# EAGLE schematic mainboard (EAGLE 6.2)
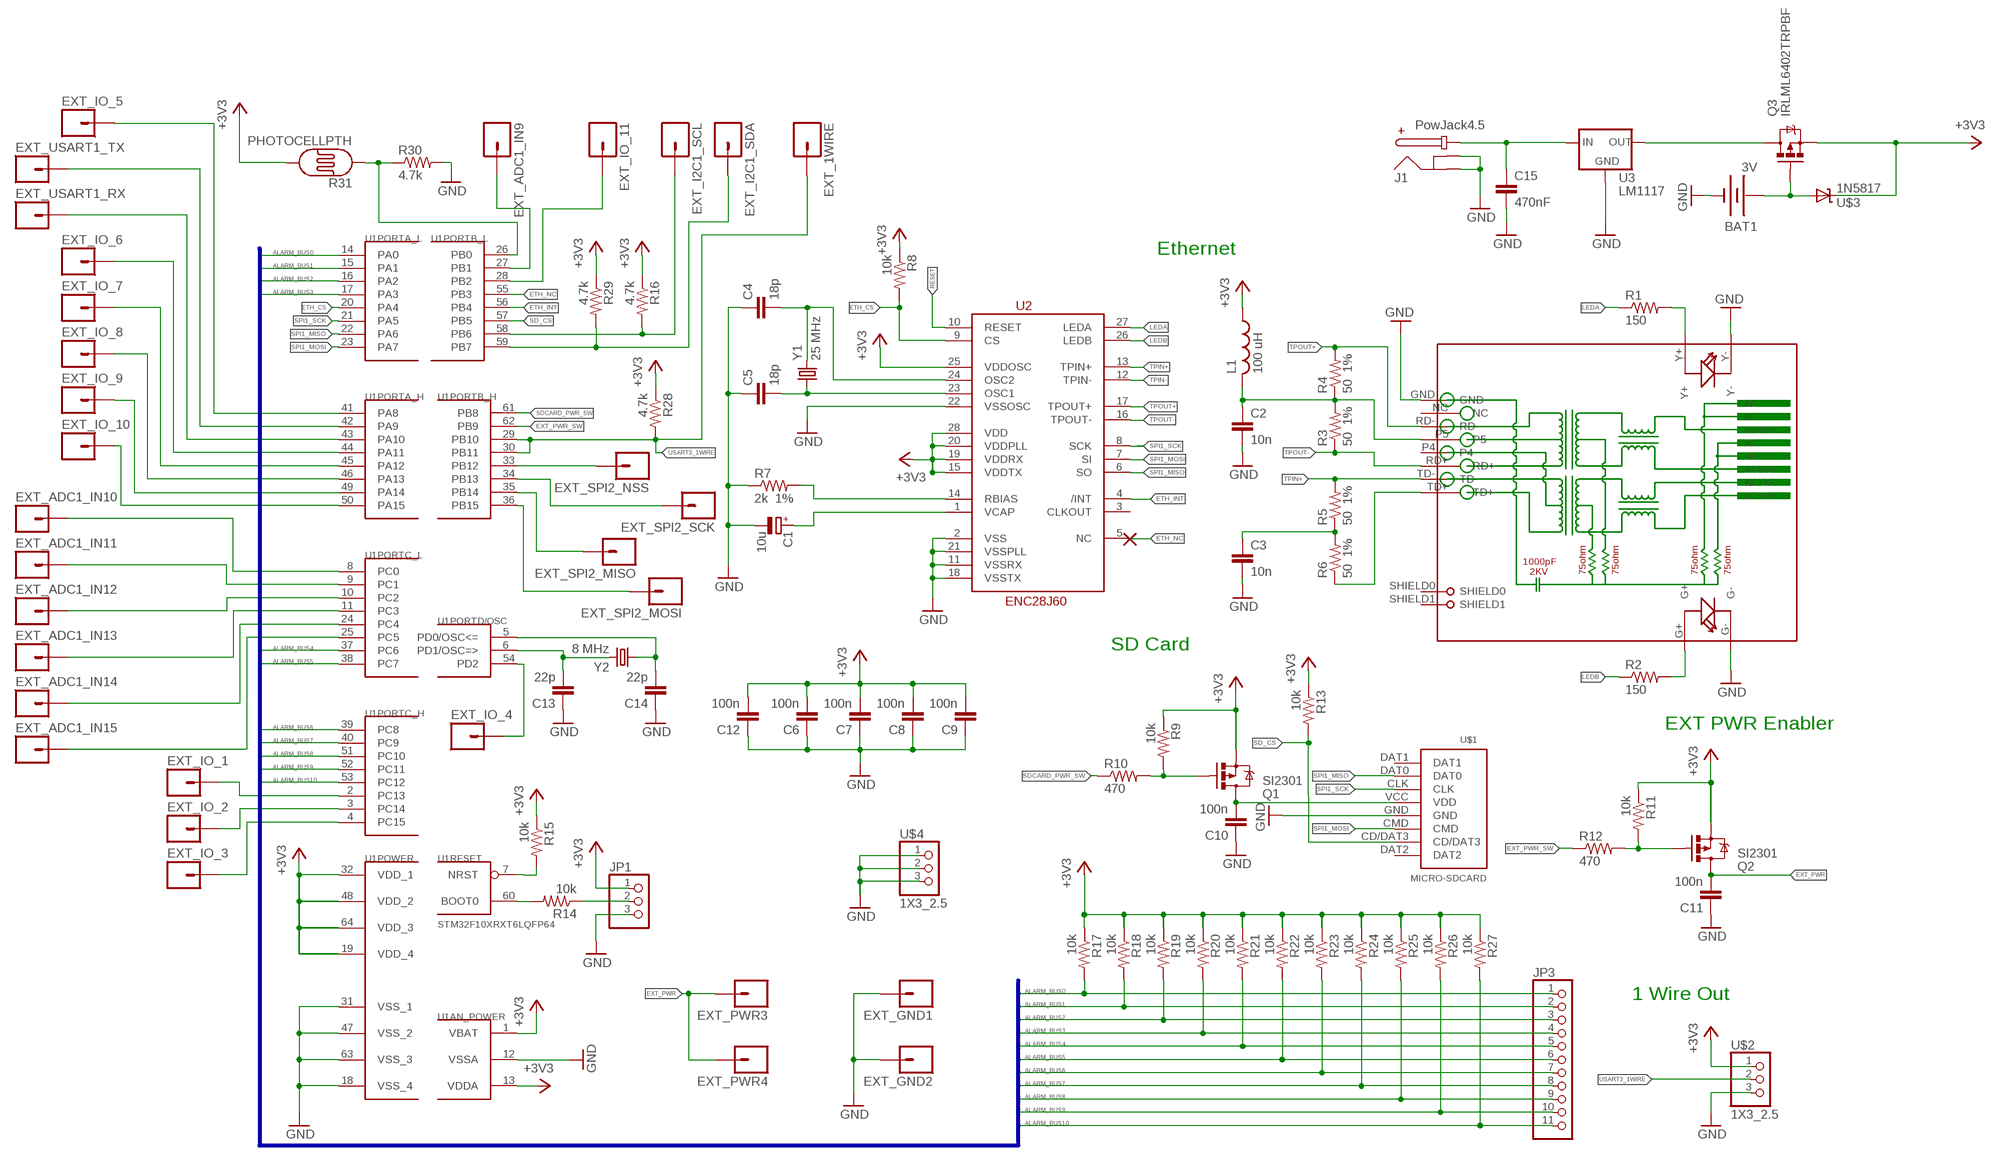
[diagram p0: schematic, sheet 1]

## Parts
BAT1  3V  BATTERY20PTH  [BATTCOM_20MM_PTH]
C1  10u  CPOL-EUSMCB  [SMC_B]
C2  10n  CAP0805  [0805]
C3  10n  CAP0805  [0805]
C4  18p  CAP0805  [0805]
C5  18p  CAP0805  [0805]
C6  100n  CAP0805  [0805]
C7  100n  CAP0805  [0805]
C8  100n  CAP0805  [0805]
C9  100n  CAP0805  [0805]
C10  100n  CAP0805  [0805]
C11  100n  CAP0805  [0805]
C12  100n  CAP0805  [0805]
C13  22p  CAP0805  [0805]
C14  22p  CAP0805  [0805]
C15  470nF  C-EUC1206  [C1206]
EXT_1WIRE  M01PTH  [1X01]
EXT_ADC1_IN9  M01PTH  [1X01]
EXT_ADC1_IN10  M01PTH  [1X01]
EXT_ADC1_IN11  M01PTH  [1X01]
EXT_ADC1_IN12  M01PTH  [1X01]
EXT_ADC1_IN13  M01PTH  [1X01]
EXT_ADC1_IN14  M01PTH  [1X01]
EXT_ADC1_IN15  M01PTH  [1X01]
EXT_GND1  M01PTH  [1X01]
EXT_GND2  M01PTH  [1X01]
EXT_I2C1_SCL  M01PTH  [1X01]
EXT_I2C1_SDA  M01PTH  [1X01]
EXT_IO_1  M01PTH  [1X01]
EXT_IO_2  M01PTH  [1X01]
EXT_IO_3  M01PTH  [1X01]
EXT_IO_4  M01PTH  [1X01]
EXT_IO_5  M01PTH  [1X01]
EXT_IO_6  M01PTH  [1X01]
EXT_IO_7  M01PTH  [1X01]
EXT_IO_8  M01PTH  [1X01]
EXT_IO_9  M01PTH  [1X01]
EXT_IO_10  M01PTH  [1X01]
EXT_IO_11  M01PTH  [1X01]
EXT_PWR3  M01PTH  [1X01]
EXT_PWR4  M01PTH  [1X01]
EXT_SPI2_MISO  M01PTH  [1X01]
EXT_SPI2_MOSI  M01PTH  [1X01]
EXT_SPI2_NSS  M01PTH  [1X01]
EXT_SPI2_SCK  M01PTH  [1X01]
EXT_USART1_RX  M01PTH  [1X01]
EXT_USART1_TX  M01PTH  [1X01]
J1  PowJack4.5  POWER_JACK_4.5POWER_JACK  [POWER_JACK_4.5]
JP1  PINHD-1X3  [1X03]
JP3  PINHD-1X11  [1X11]
L1  100 uH  L-USWE-TPC  [POWER-CHOKE_WE-TPC]
Q1  SI2301  MOSFET-PCHANNELSMD  [SOT23-3]
Q2  SI2301  MOSFET-PCHANNELSMD  [SOT23-3]
Q3  IRLML6402TRPBF  MOSFET-PCHANNELSMD  [SOT23-3]
R1  150  RESISTOR0805-RES  [0805]
R2  150  RESISTOR0805-RES  [0805]
R3  50 1%  RESISTOR0805-RES  [0805]
R4  50 1%  RESISTOR0805-RES  [0805]
R5  50 1%  RESISTOR0805-RES  [0805]
R6  50 1%  RESISTOR0805-RES  [0805]
R7  2k 1%  RESISTOR0805-RES  [0805]
R8  10k  RESISTOR0805-RES  [0805]
R9  10k  RESISTOR0805-RES  [0805]
R10  470  RESISTOR0805-RES  [0805]
R11  10k  RESISTOR0805-RES  [0805]
R12  470  RESISTOR0805-RES  [0805]
R13  10k  RESISTOR0805-RES  [0805]
R14  10k  RESISTOR0805-RES  [0805]
R15  10k  RESISTOR0805-RES  [0805]
R16  4.7k  RESISTOR0805-RES  [0805]
R17  10k  RESISTOR0805-RES  [0805]
R18  10k  RESISTOR0805-RES  [0805]
R19  10k  RESISTOR0805-RES  [0805]
R20  10k  RESISTOR0805-RES  [0805]
R21  10k  RESISTOR0805-RES  [0805]
R22  10k  RESISTOR0805-RES  [0805]
R23  10k  RESISTOR0805-RES  [0805]
R24  10k  RESISTOR0805-RES  [0805]
R25  10k  RESISTOR0805-RES  [0805]
R26  10k  RESISTOR0805-RES  [0805]
R27  10k  RESISTOR0805-RES  [0805]
R28  4.7k  RESISTOR0805-RES  [0805]
R29  4.7k  RESISTOR0805-RES  [0805]
R30  4.7k  RESISTOR0805-RES  [0805]
R31  PHOTOCELLPTH  [PHOTOCELL]
RJ1  HR911105A  [HR911105A]
U1  STM32F10XRXT6LQFP64  [LQFP64_MILL]
U2  ENC28J60  [SSOP28DB]
U3  LM1117  V_REG_MC33269DT  [DPAK]
U$1  MICRO-SDCARD  [MICRO-SDCARD]
U$2  1X3_2.5  [1X3_2.5]
U$3  1N5817  DIODE-ZENERPTH  [DIODE-ZENER]
U$4  1X3_2.5  [1X3_2.5]
Y1  25 MHz  CRYSTALHC49UV  [HC49U-V]
Y2  8 MHz  CRYSTALHC49UV  [HC49U-V]

## Nets
+3V3: C6.2 C7.2 C8.2 C9.2 C12.2 JP1.1 L1.1 Q1.2(S) Q2.2(S) Q3.2(S) R8.1 R9.1 R11.1 R13.1 R15.1 R16.1 R17.1 R18.1 R19.1 R20.1 R21.1 R22.1 R23.1 R24.1 R25.1 R26.1 R27.1 R28.1 R29.1 R31.2 U1.1(AN_POWER:VBAT) U1.13(AN_POWER:VDDA) U1.19(POWER:VDD_4) U1.32(POWER:VDD_1) U1.48(POWER:VDD_2) U1.64(POWER:VDD_3) U2.15(VDDTX) U2.19(VDDRX) U2.20(VDDPLL) U2.25(VDDOSC) U2.28(VDD) U$2.1 U$3.P$1(C)
ALARM_BUS0: JP3.1 R17.2 U1.14(PORTA_L:PA0)
ALARM_BUS1: JP3.2 R18.2 U1.15(PORTA_L:PA1)
ALARM_BUS2: JP3.3 R19.2 U1.16(PORTA_L:PA2)
ALARM_BUS3: JP3.4 R20.2 U1.17(PORTA_L:PA3)
ALARM_BUS4: JP3.5 R21.2 U1.37(PORTC_L:PC6)
ALARM_BUS5: JP3.6 R22.2 U1.38(PORTC_L:PC7)
ALARM_BUS6: JP3.7 R23.2 U1.39(PORTC_H:PC8)
ALARM_BUS7: JP3.8 R24.2 U1.40(PORTC_H:PC9)
ALARM_BUS8: JP3.9 R25.2 U1.51(PORTC_H:PC10)
ALARM_BUS9: JP3.10 R26.2 U1.52(PORTC_H:PC11)
ALARM_BUS10: JP3.11 R27.2 U1.53(PORTC_H:PC12)
ETH_CS: R8.2 U2.9(CS)
ETH_INT: U1.56(PORTB_L:PB4) U2.4(/INT)
ETH_NC: U1.55(PORTB_L:PB3) U2.5(NC)
EXT_PWR: C11.2 EXT_PWR3.1 EXT_PWR4.1 Q2.3(D)
EXT_PWR_SW: R12.1 U1.62(PORTB_H:PB9)
GND: BAT1.2(-) C1.- C2.2 C3.2 C4.1 C5.1 C6.1 C7.1 C8.1 C9.1 C10.1 C11.1 C12.1 C13.1 C14.1 C15.2 EXT_GND1.1 EXT_GND2.1 J1.GND@1(GND) J1.GND@2(GNDBREAK) JP1.3 R7.1 R30.2 RJ1.G- RJ1.GND RJ1.Y- U1.12(AN_POWER:VSSA) U1.18(POWER:VSS_4) U1.31(POWER:VSS_1) U1.47(POWER:VSS_2) U1.63(POWER:VSS_3) U2.2(VSS) U2.11(VSSRX) U2.18(VSSTX) U2.21(VSSPLL) U2.22(VSSOSC) U3.1(GND) U$1.GND U$2.3 U$4.1 U$4.2 U$4.3
I2C1_SCL: EXT_I2C1_SCL.1 R16.2 U1.58(PORTB_L:PB6)
I2C1_SDA: EXT_I2C1_SDA.1 R29.2 U1.59(PORTB_L:PB7)
LEDA: R1.1 U2.27(LEDA)
LEDB: R2.1 U2.26(LEDB)
N$1: C2.1 L1.2 R3.2 R4.1 RJ1.P5
N$2: R2.2 RJ1.G+
N$3: R1.2 RJ1.Y+
N$4: R7.2 U2.14(RBIAS)
N$5: C5.2 U2.23(OSC1) Y1.1
N$6: C4.2 U2.24(OSC2) Y1.2
N$7: C1.+ U2.1(VCAP)
N$8: Q2.1(G) R11.2 R12.2
N$9: C3.1 R5.1 R6.2
N$10: Q1.1(G) R9.2 R10.2
N$11: C10.2 Q1.3(D) U$1.VCC(VDD)
N$12: EXT_IO_1.1 U1.2(PORTC_H:PC13)
N$13: R14.2 U1.60(RESET:BOOT0)
N$14: JP1.2 R14.1
N$15: R15.2 U1.7(RESET:NRST)
N$16: C14.2 U1.5(PORTD/OSC:PD0/OSC<=) Y2.1
N$17: C13.2 U1.6(PORTD/OSC:PD1/OSC=>) Y2.2
N$18: C15.1 J1.PWR U3.3(IN)
N$19: EXT_IO_2.1 U1.3(PORTC_H:PC14)
N$20: EXT_IO_3.1 U1.4(PORTC_H:PC15)
N$21: EXT_IO_4.1 U1.54(PORTD/OSC:PD2)
N$22: EXT_IO_5.1 U1.41(PORTA_H:PA8)
N$23: EXT_USART1_TX.1 U1.42(PORTA_H:PA9)
N$24: EXT_USART1_RX.1 U1.43(PORTA_H:PA10)
N$25: EXT_IO_6.1 U1.44(PORTA_H:PA11)
N$26: EXT_IO_7.1 U1.45(PORTA_H:PA12)
N$27: EXT_IO_8.1 U1.46(PORTA_H:PA13)
N$28: EXT_IO_9.1 U1.49(PORTA_H:PA14)
N$29: EXT_IO_10.1 U1.50(PORTA_H:PA15)
N$30: R30.1 R31.1 U1.26(PORTB_L:PB0)
N$31: EXT_ADC1_IN9.1 U1.27(PORTB_L:PB1)
N$32: EXT_ADC1_IN15.1 U1.25(PORTC_L:PC5)
N$33: EXT_ADC1_IN14.1 U1.24(PORTC_L:PC4)
N$34: EXT_ADC1_IN13.1 U1.11(PORTC_L:PC3)
N$35: EXT_ADC1_IN12.1 U1.10(PORTC_L:PC2)
N$36: EXT_ADC1_IN11.1 U1.9(PORTC_L:PC1)
N$37: EXT_ADC1_IN10.1 U1.8(PORTC_L:PC0)
N$38: BAT1.1(+) Q3.1(G) U$3.P$2(A)
N$39: EXT_IO_11.1 U1.28(PORTB_L:PB2)
N$42: Q3.3(D) U3.4(OUT)
RESET: U2.10(RESET)
SD_CS: R13.2 U1.57(PORTB_L:PB5) U$1.CD/DAT3
SDCARD_PWR_SW: R10.1 U1.61(PORTB_H:PB8)
SPI1_MISO: U1.22(PORTA_L:PA6) U2.6(SO) U$1.DAT0
SPI1_MOSI: U1.23(PORTA_L:PA7) U2.7(SI) U$1.CMD
SPI1_SCK: U1.21(PORTA_L:PA5) U2.8(SCK) U$1.CLK
SPI2_MISO: EXT_SPI2_MISO.1 U1.35(PORTB_H:PB14)
SPI2_MOSI: EXT_SPI2_MOSI.1 U1.36(PORTB_H:PB15)
SPI2_NSS: EXT_SPI2_NSS.1 U1.33(PORTB_H:PB12)
SPI2_SCK: EXT_SPI2_SCK.1 U1.34(PORTB_H:PB13)
TPIN+: R5.2 RJ1.TD- U2.13(TPIN+)
TPIN-: R6.1 RJ1.TD+ U2.12(TPIN-)
TPOUT+: R4.2 RJ1.RD- U2.17(TPOUT+)
TPOUT-: R3.1 RJ1.RD+ U2.16(TPOUT-)
USART3_1WIRE: EXT_1WIRE.1 R28.2 U1.29(PORTB_H:PB10) U1.30(PORTB_H:PB11) U$2.2
Unconnected: RJ1.NC RJ1.P4 RJ1.SHIELD0 RJ1.SHIELD1 U1.20(PORTA_L:PA4) U2.3(CLKOUT) U$1.DAT1 U$1.DAT2

## Buses
ALARM_BUS[0..10]

## Notes on the sheet
- Ethernet
- SD Card
- EXT PWR Enabler
- 1 Wire Out

## Library data of the parts
BAT1 = SparkFun:BATTERY: Battery Holders Various common sizes : AA, AAA, 20mm coin cell and 12mm coin cell.
C1 = GravicapaLib:CPOL-EU: POLARIZED CAPACITOR, European symbol
C2-C14 = GravicapaLib:CAP: Capacitor Standard 0603 ceramic capacitor, and 0.1" leaded capacitor.
C15 = rcl:C-EU: CAPACITOR, European symbol
EXT_1WIRE EXT_ADC1_IN9-EXT_ADC1_IN15 EXT_GND1 EXT_GND2 EXT_I2C1_SCL EXT_I2C1_SDA EXT_IO_1-EXT_IO_11 EXT_PWR3 EXT_PWR4 EXT_SPI2_MISO EXT_SPI2_MOSI EXT_SPI2_NSS EXT_SPI2_SCK EXT_USART1_RX EXT_USART1_TX = GravicapaLib:M01: Header 1 Standard 1-pin 0.1" header. Use with straight break away headers (SKU : PRT-00116), right angle break away headers (PRT-00553), swiss pins (PRT-00743), machine pins (PRT-00117), and female headers (PRT-00115).
J1 = GravicapaLib:POWER_JACK_4.5: Power Jack This is the standard 5.5mm barrel jack for power. The PTH is the most common, proven, reliable, footprint. All others are experimental. The Slot footprint only works if the mill layer is transmitted to the PCB fab house so be warned. Spark Fun Electronics SKU : PRT-00119. Mating wall wart : TOL-00298 (and others)
JP1 = GravicapaLib:PINHD-1X3: PIN HEADER
JP3 = GravicapaLib:PINHD-1X11: PIN HEADER
L1 = GravicapaLib:L-US: INDUCTOR, American symbol
Q1-Q3 = GravicapaLib:MOSFET-PCHANNEL
R1-R30 = GravicapaLib:RESISTOR: Resistor Basic schematic elements and footprints for 0603, 1206, and PTH resistors.
R31 = SparkFun:PHOTOCELL: Photocell Also known as a CdS photoresistor. This is a low cost way to detect light levels. Resistance decreases with more incoming light. SparkFun SKU: SEN-09088
RJ1 = GravicapaLib:HR911105A
U1 = GravicapaLib:STM32F10XRXT6: STM32F101/103 64pin LQFP
U2 = GravicapaLib:ENC28J60
U3 = GravicapaLib:V_REG_MC33269
U$1 = GravicapaLib:MICRO-SDCARD
U$2 U$4 = GravicapaLib:1X3_2.5
U$3 = SparkFun:DIODE-ZENER: Zener Diode Production Part - 8199 3.4V Zener Voltage
Y1 Y2 = GravicapaLib:CRYSTAL: Crystals Various standard crystals. Proven footprints. Spark Fun Electronics SKU : COM-00534